# EAGLE schematic TRADFRIICC-1dimmer (EAGLE 9.6.2)
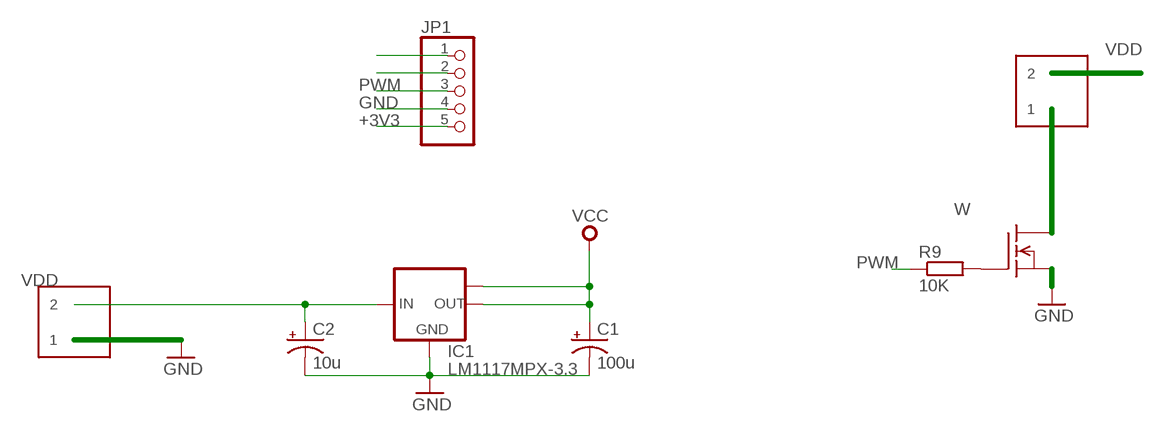
[diagram p0: schematic, sheet 1]

## Parts
C1  100u  CPOL-USCT3528  [CT3528]
C2  10u  CPOL-USC/6032-28R  [C/6032-28R]
IC1  LM1117MPX-3.3  [SOT223]
JP1  PINHD-1X55X2MM  [1_05X2MM]
PWR_IN  KF350-P2  [KF350-2P]
PWR_IN1  KF350-P2  [KF350-2P]
R9  10K  R-EU_R0603  [R0603]
W  FDS5680  [SO-8]

## Nets
+3V3: C1.+ IC1.2(OUT) IC1.TAB(OUT1) JP1.5 ; supply symbol labelled VCC
DW: PWR_IN1.1 W.5(D) W.6(D) W.7(D) W.8(D)
GND: C1.- C2.- IC1.1(GND) JP1.4 PWR_IN.1 W.1(S) W.2(S) W.3(S)
N$4: JP1.2
N$5: JP1.1
N$13: R9.2 W.4(G)
PWM: JP1.3 R9.1
VDD: C2.+ IC1.3(IN) PWR_IN1.2 PWR_IN.2

## Library data of the parts
C1 C2 = rcl:CPOL-US: POLARIZED CAPACITOR, American symbol; SPICEPREFIX: C
IC1 = lm1117:LM1117MPX-*
JP1 = pinhead:PINHD-1X5: PIN HEADER
PWR_IN PWR_IN1 = KF350-P2:KF350-P2
R9 = resistor:R-EU_: RESISTOR, European symbol
W = transistor-fet:FDS5680: 60V N-Channel PowerTrench TM MOSFET FAIRCHILD FDS5680.pdf